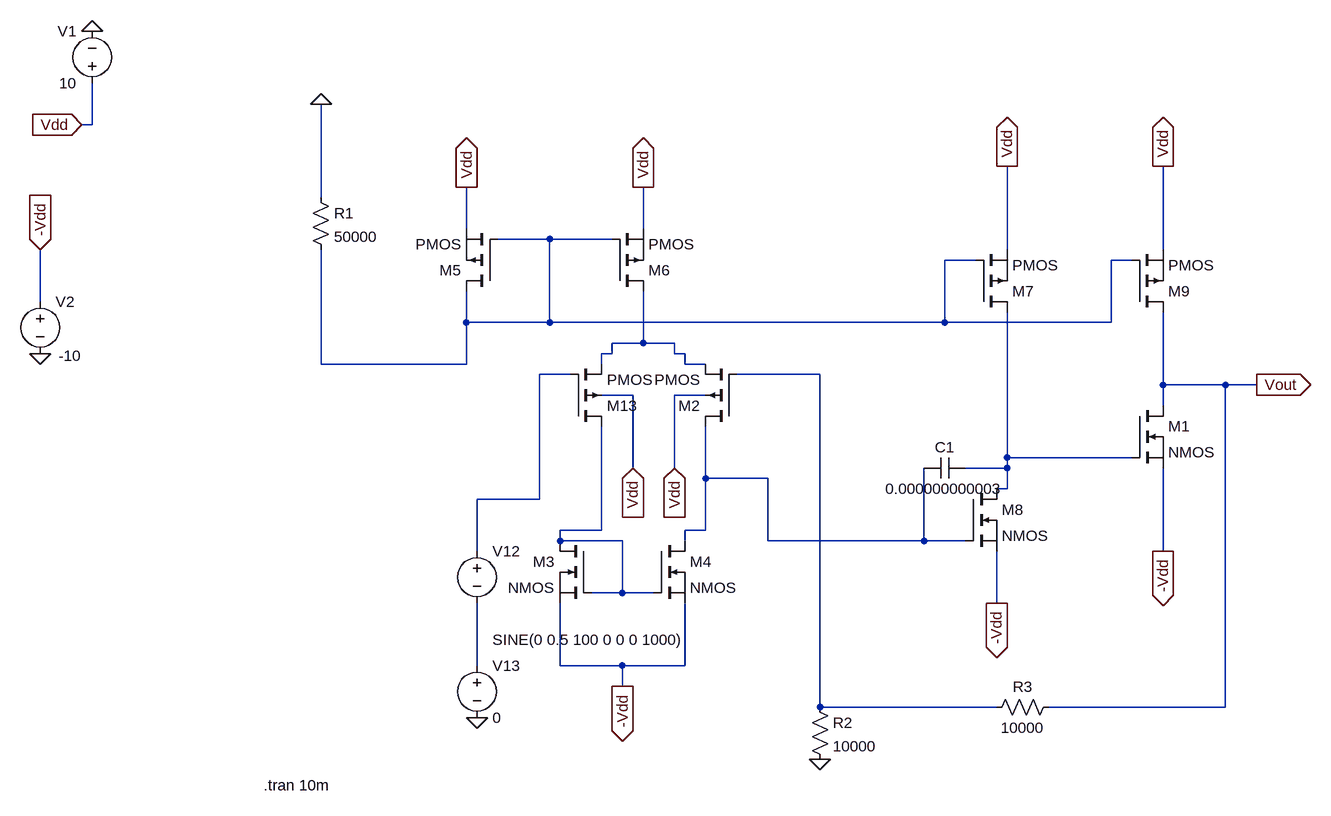
[diagram p0: schematic Op_Amp_Model_4_29_2017.asc]
Op_Amp_Model_4_29_2017.asc, the LTspice schematic file:
Version 4
SHEET 1 1400 760
WIRE -576 -272 -576 -336
WIRE -576 -272 -592 -272
WIRE -224 -160 -224 -304
WIRE 0 -112 0 -176
WIRE 272 -112 272 -176
WIRE 128 -96 48 -96
WIRE 224 -96 128 -96
WIRE 832 -80 832 -208
WIRE 1072 -80 1072 -208
WIRE 784 -64 736 -64
WIRE 1024 -64 992 -64
WIRE -656 0 -656 -80
WIRE 0 32 0 -16
WIRE 128 32 128 -96
WIRE 128 32 0 32
WIRE 736 32 736 -64
WIRE 736 32 128 32
WIRE 992 32 992 -64
WIRE 992 32 736 32
WIRE 272 64 272 -16
WIRE 272 64 224 64
WIRE 320 64 272 64
WIRE 224 80 224 64
WIRE 224 80 208 80
WIRE 320 80 320 64
WIRE 336 80 320 80
WIRE -224 96 -224 -80
WIRE 0 96 0 32
WIRE 0 96 -224 96
WIRE 208 96 208 80
WIRE 336 96 336 80
WIRE 368 96 336 96
WIRE 160 112 112 112
WIRE 544 112 416 112
WIRE 1072 128 1072 16
WIRE 1168 128 1072 128
WIRE 1216 128 1168 128
WIRE 256 144 208 144
WIRE 368 144 320 144
WIRE 1072 160 1072 128
WIRE 832 240 832 16
WIRE 1024 240 832 240
WIRE 256 256 256 144
WIRE 320 256 320 144
WIRE 832 256 832 240
WIRE 832 256 768 256
WIRE 368 272 368 192
WIRE 464 272 368 272
WIRE 832 288 832 256
WIRE 832 288 816 288
WIRE 112 304 112 112
WIRE 112 304 16 304
WIRE 208 352 208 192
WIRE 208 352 144 352
WIRE 368 352 368 272
WIRE 368 352 336 352
WIRE 144 368 144 352
WIRE 240 368 144 368
WIRE 336 368 336 352
WIRE 464 368 464 272
WIRE 704 368 704 256
WIRE 704 368 464 368
WIRE 768 368 704 368
WIRE 16 384 16 304
WIRE 1072 384 1072 256
WIRE 240 448 240 368
WIRE 240 448 192 448
WIRE 288 448 240 448
WIRE 816 464 816 384
WIRE 16 560 16 464
WIRE 144 560 144 464
WIRE 240 560 144 560
WIRE 336 560 336 464
WIRE 336 560 240 560
WIRE 240 592 240 560
WIRE 544 624 544 112
WIRE 816 624 544 624
WIRE 1168 624 1168 128
WIRE 1168 624 896 624
FLAG 1216 128 Vout
IOPIN 1216 128 Out
FLAG 16 640 0
FLAG 544 704 0
FLAG -592 -272 Vdd
IOPIN -592 -272 In
FLAG -576 -416 0
FLAG 0 -176 Vdd
IOPIN 0 -176 Out
FLAG 272 -176 Vdd
IOPIN 272 -176 Out
FLAG 832 -208 Vdd
IOPIN 832 -208 Out
FLAG 1072 -208 Vdd
IOPIN 1072 -208 Out
FLAG -656 80 0
FLAG -656 -80 -Vdd
IOPIN -656 -80 In
FLAG 240 592 -Vdd
IOPIN 240 592 Out
FLAG 816 464 -Vdd
IOPIN 816 464 Out
FLAG 1072 384 -Vdd
IOPIN 1072 384 Out
FLAG -224 -304 0
FLAG 256 256 Vdd
IOPIN 256 256 In
FLAG 320 256 Vdd
IOPIN 320 256 In
SYMBOL nmos 288 368 R0
SYMATTR InstName M4
SYMBOL nmos 192 368 M0
SYMATTR InstName M3
SYMBOL pmos 784 16 M180
SYMATTR InstName M7
SYMBOL pmos 1024 16 M180
SYMATTR InstName M9
SYMBOL nmos 768 288 R0
SYMATTR InstName M8
SYMBOL cap 768 240 R90
WINDOW 0 0 32 VBottom 2
WINDOW 3 32 32 VTop 2
SYMATTR InstName C1
SYMATTR Value 0.000000000003
SYMBOL res -240 -176 R0
SYMATTR InstName R1
SYMATTR Value 50000
SYMBOL voltage -576 -320 R180
WINDOW 0 24 96 Left 2
WINDOW 3 24 16 Left 2
WINDOW 123 0 0 Left 2
WINDOW 39 0 0 Left 2
SYMATTR InstName V1
SYMATTR Value 10
SYMBOL voltage 16 368 R0
WINDOW 3 24 152 Left 2
WINDOW 123 24 124 Left 2
WINDOW 39 0 0 Left 2
SYMATTR InstName V12
SYMATTR Value SINE(0 0.5 100 0 0 0 1000)
SYMBOL voltage 16 544 R0
WINDOW 123 0 0 Left 2
WINDOW 39 0 0 Left 2
SYMATTR InstName V13
SYMATTR Value 0
SYMBOL voltage -656 -16 R0
WINDOW 3 28 99 Left 2
WINDOW 123 0 0 Left 2
WINDOW 39 0 0 Left 2
SYMATTR Value -10
SYMATTR InstName V2
SYMBOL pmos 48 -16 R180
SYMATTR InstName M5
SYMBOL pmos 224 -16 M180
SYMATTR InstName M6
SYMBOL pmos4 416 192 R180
SYMATTR InstName M2
SYMBOL pmos4 160 192 M180
SYMATTR InstName M13
SYMBOL nmos 1024 160 R0
SYMATTR InstName M1
SYMBOL res 528 608 R0
SYMATTR InstName R2
SYMATTR Value 10000
SYMBOL res 912 608 R90
WINDOW 0 0 56 VBottom 2
WINDOW 3 32 56 VTop 2
SYMATTR InstName R3
SYMATTR Value 10000
TEXT -312 744 Left 2 !.tran 10m

The netlist it stands for:
* Op_Amp_Model_4_29_2017.asc
M4 N006 N007 -Vdd -Vdd NMOS
M3 N007 N007 -Vdd -Vdd NMOS
M7 N005 N001 Vdd Vdd PMOS
M9 Vout N001 Vdd Vdd PMOS
M8 N005 N006 -Vdd -Vdd NMOS
C1 N005 N006 0.000000000003
R1 0 N001 50000
V1 Vdd 0 10
V12 N003 N008 SINE(0 0.5 100 0 0 0 1000)
V13 N008 0 0
V2 -Vdd 0 -10
M5 N001 N001 Vdd Vdd PMOS
M6 N002 N001 Vdd Vdd PMOS
M2 N006 N004 N002 Vdd PMOS
M13 N007 N003 N002 Vdd PMOS
M1 Vout N005 -Vdd -Vdd NMOS
R2 N004 0 10000
R3 Vout N004 10000
.model NMOS NMOS
.model PMOS PMOS
.lib standard.mos
.tran 10m
.backanno
.end